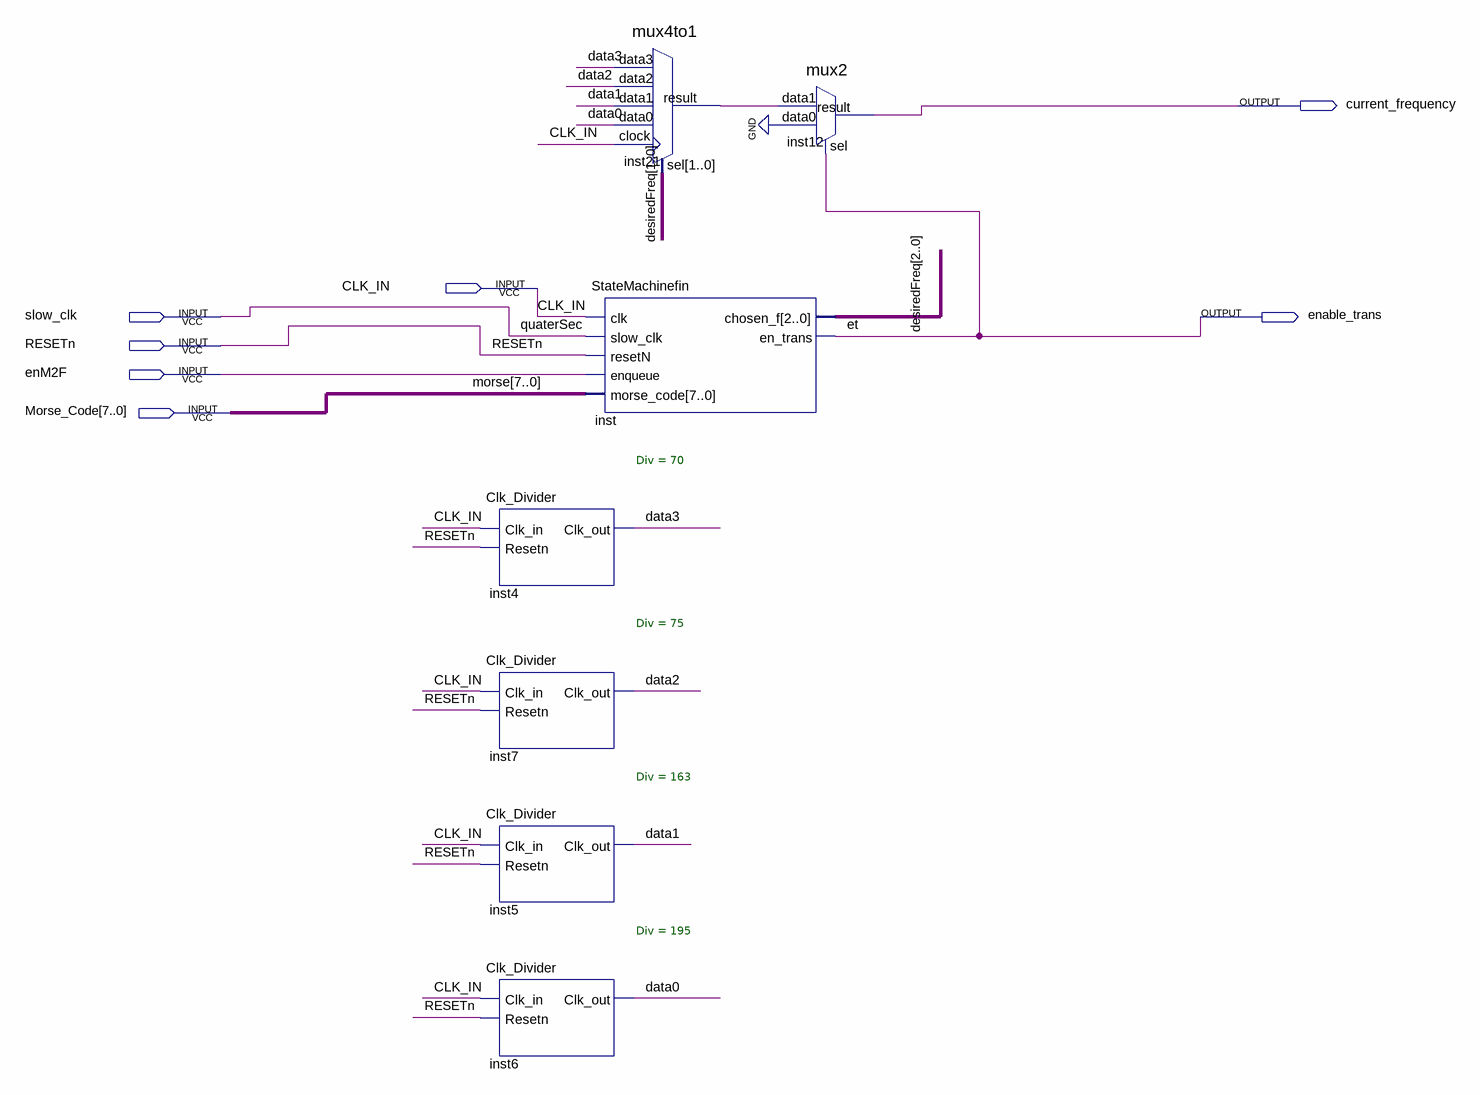
[diagram p0: schematic sheet]
// Quartus schematic MORSE2FREQ.bdf as structural Verilog: 7 symbols, 7 pins
module MORSE2FREQ (
  input  CLK_IN,
  input  slow_clk,
  input  RESETn,
  input  enM2F,
  input  [7:0] Morse_Code,
  output current_frequency,
  output enable_trans
);

  wire data0, data1, data2, data3, inst21_result;
  wire [2:0] desiredFreq;

  Clk_Divider #(.Div(70)) inst4 (.Clk_in(CLK_IN), .Resetn(RESETn), .Clk_out(data3));
  Clk_Divider #(.Div(75)) inst7 (.Clk_in(CLK_IN), .Resetn(RESETn), .Clk_out(data2));
  Clk_Divider #(.Div(163)) inst5 (.Clk_in(CLK_IN), .Resetn(RESETn), .Clk_out(data1));
  Clk_Divider #(.Div(195)) inst6 (.Clk_in(CLK_IN), .Resetn(RESETn), .Clk_out(data0));
  StateMachinefin inst (
    .clk(CLK_IN), .slow_clk(slow_clk), .resetN(RESETn), .enqueue(enM2F), .morse_code(Morse_Code),
    .chosen_f(desiredFreq), .en_trans(enable_trans));
  mux4to1 inst21 (
    .data3(data3), .data2(data2), .data1(data1), .data0(data0), .clock(CLK_IN), .sel(desiredFreq[1:0]),
    .result(inst21_result));
  mux2 inst12 (.data1(inst21_result), .data0(1'b0), .sel(enable_trans), .result(current_frequency));

  // Other names for the same wires on the sheet: et = enable_trans; morse[7:0] = Morse_Code; quaterSec = slow_clk
endmodule
